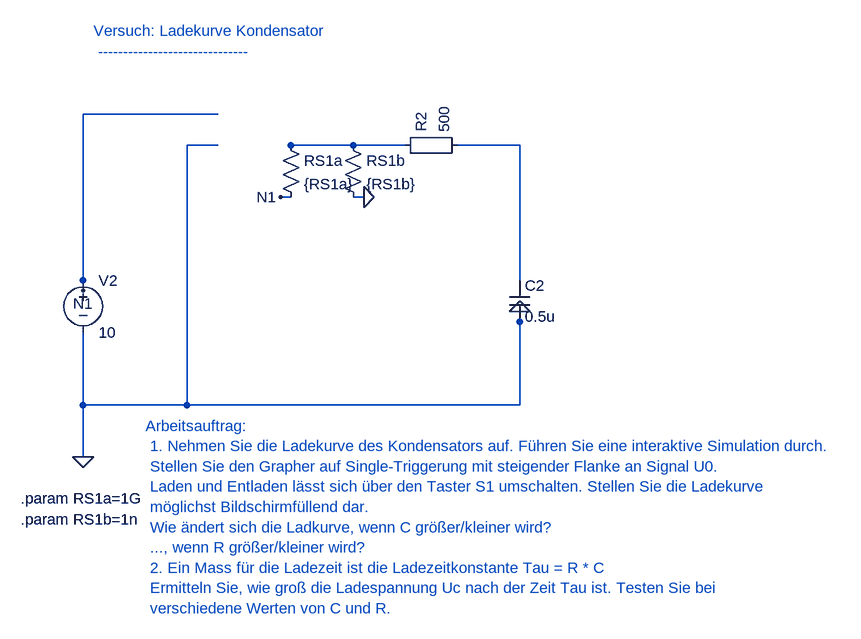
[diagram p0: schematic 1_1_1_C_Ladekurve.asc]
1_1_1_C_Ladekurve.asc, the LTspice schematic file:
Version 4
SHEET 1 880 680
WIRE 160 528 160 544
WIRE 480 240 576 240
WIRE 832 512 832 528
WIRE 368 192 160 192
WIRE 160 192 160 448
WIRE 160 544 160 640
WIRE 160 640 160 720
WIRE 736 240 832 240
WIRE 832 240 832 448
WIRE 480 240 656 240
WIRE 832 528 832 640
WIRE 832 640 320 640
WIRE 320 640 160 640
WIRE 368 240 320 240
WIRE 320 240 320 640
WIRE 480 320 464 320
WIRE 160 448 160 464
WIRE 832 512 832 496
WIRE 576 320 592 320
FLAG 160 720 0
FLAG 464 320 N1
FLAG 160 464 N1
FLAG 832 496 0
FLAG 592 320 0
SYMBOL voltage 160 432 R0
SYMATTR InstName V2
SYMATTR Value 10
SYMBOL res 464 224 R0
SYMATTR InstName RS1a
SYMATTR Value {RS1a}
SYMBOL res 560 224 R0
SYMATTR InstName RS1b
SYMATTR Value {RS1b}
SYMBOL Misc\EuropeanResistor 640 256 R270
SYMATTR InstName R2
SYMATTR Value 500
SYMBOL cap 816 448 R0
SYMATTR InstName C2
SYMATTR Value 0.5u
TEXT 64 784 Left 2 !.param RS1a=1G
TEXT 64 816 Left 2 !.param RS1b=1n
TEXT 176 64 Left 2 ;Versuch: Ladekurve Kondensator \n ------------------------------
TEXT 256 672 Left 2 ;Arbeitsauftrag: \n 1. Nehmen Sie die Ladekurve des Kondensators auf. Führen Sie eine interaktive Simulation durch. \n Stellen Sie den Grapher auf Single-Triggerung mit steigender Flanke an Signal U0. \n Laden und Entladen lässt sich über den Taster S1 umschalten. Stellen Sie die Ladekurve \n möglichst Bildschirmfüllend dar. \n Wie ändert sich die Ladkurve, wenn C größer/kleiner wird? \n ..., wenn R größer/kleiner wird? \n 2. Ein Mass für die Ladezeit ist die Ladezeitkonstante Tau = R * C \n Ermitteln Sie, wie groß die Ladespannung Uc nach der Zeit Tau ist. Testen Sie bei \n verschiedene Werten von C und R.

The netlist it stands for:
* 1_1_1_C_Ladekurve.asc
V2 N1 0 10
RS1a N001 N1 {RS1a}
RS1b N001 0 {RS1b}
R2 N001 N002 500
C2 N002 0 0.5u
.param RS1a=1G
.param RS1b=1n
* Versuch: Ladekurve Kondensator
*  ------------------------------
* Arbeitsauftrag:
*  1. Nehmen Sie die Ladekurve des Kondensators auf. Führen Sie eine interaktive Simulation durch.
*  Stellen Sie den Grapher auf Single-Triggerung mit steigender Flanke an Signal U0.
*  Laden und Entladen lässt sich über den Taster S1 umschalten. Stellen Sie die Ladekurve
*  möglichst Bildschirmfüllend dar.
*  Wie ändert sich die Ladkurve, wenn C größer/kleiner wird?
*  ..., wenn R größer/kleiner wird?
*  2. Ein Mass für die Ladezeit ist die Ladezeitkonstante Tau = R * C
*  Ermitteln Sie, wie groß die Ladespannung Uc nach der Zeit Tau ist. Testen Sie bei
*  verschiedene Werten von C und R.
.backanno
.end